# Altium schematic sheet Motortreiber_5,6.SchDoc: SysP18_Team10: Motortreiber 5/6
size A4; CheckedBy: Kyburz Falk; Author: Michael Alig; CompanyName: NTB; Organization: NTB Interstate University of Applied; Address1: Werdenbergstrasse 4; Address3: 9471 Buchs; Address4: Switzerland; Revision: 14.03.2018; SheetNumber: 5; SheetTotal: 5; Organization1: Sciences of Technology Buchs; Size: A4; ShortDescription: Motortreiber Motor 5, Motor6
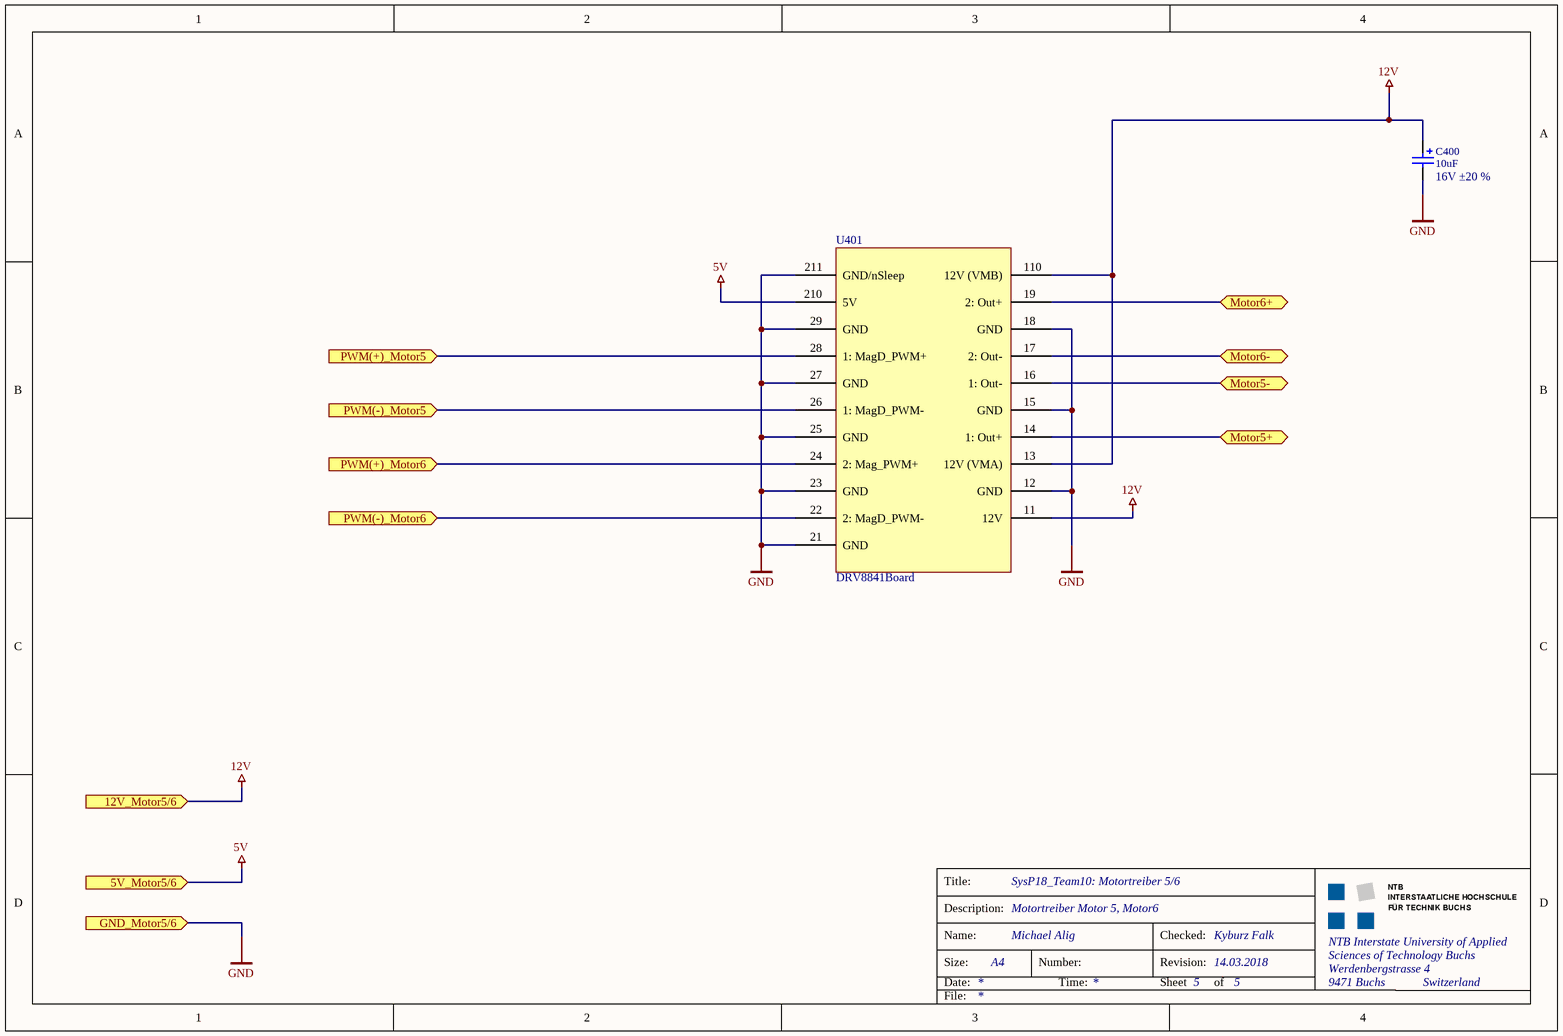
[diagram p0: Motortreiber_5,6.SchDoc]

## Parts
C400  value 10uF  ValueAddon: 16V ±20 %  [CDE_CAP AVE CODE D_H]  (hidden comment: AVE476M16D16T-F)
U401  DRV8841Board  [DRV8841_Board]

## Ports
5V_Motor5/6 (in), 12V_Motor5/6 (in), GND_Motor5/6 (in), Motor5+, Motor5-, Motor6+, Motor6-, PWM(+)_Motor5 (in), PWM(+)_Motor6 (in), PWM(-)_Motor5 (in), PWM(-)_Motor6 (in)

## Nets
5V: U401.210(5V) ; port 5V_Motor5/6
12V: C400.1(Pos) U401.11(12V) U401.13(12V_(VMA)) U401.110(12V_(VMB)) ; port 12V_Motor5/6
GND: C400.2(Neg) U401.12(GND) U401.15(GND) U401.18(GND) U401.21(GND) U401.23(GND) U401.25(GND) U401.27(GND) U401.29(GND) U401.211(GND/nSleep) ; port GND_Motor5/6
Motor5+: U401.14(1:_Out+) ; port Motor5+
Motor5-: U401.16(1:_Out-) ; port Motor5-
Motor6+: U401.19(2:_Out+) ; port Motor6+
Motor6-: U401.17(2:_Out-) ; port Motor6-
PWM(+)_Motor5: U401.28(1:_MagD_PWM+) ; port PWM(+)_Motor5
PWM(+)_Motor6: U401.24(2:_Mag_PWM+) ; port PWM(+)_Motor6
PWM(-)_Motor5: U401.26(1:_MagD_PWM-) ; port PWM(-)_Motor5
PWM(-)_Motor6: U401.22(2:_MagD_PWM-) ; port PWM(-)_Motor6

## Notes on the sheet
- Title:
- Description:
- Size:
- Date:
- Name:
- Number:
- Time:
- Revision:
- Sheet
- Checked:
- of
- File:

## Library data of the parts
C400 = CDE_AVE476M16D16T-F_AVE CODE D: Aluminum Electrolytic Capacitors for Filtering and Bypass, 47uF, 16V; Manufacturer: Cornell Dubilier; #Class: PASSIVE; RefFootprint: CDE_CAP AVE CODE D; #ClassSub: CAPACITOR; Distributor PartNr: 598-AVE476M16D16T-F; Distributor: Mouser; Published: 20121220; Publisher: Stefan Ursella, M.Eng; ComponentLink1Description: Manufacturer Link; ComponentLink2Description: Datasheet; ComponentLink2URL: http://www.cde.com/catalogs/AVE.pdf; ComponentLink3Description: Packaging Specification; Manufacturer PartNr: AVE476M16D16T-F; RefFileFOO: *; RefFileSCH: *; RefSchema: CDE_AVE476M16D16T-F_AVE CODE D
U401 = DRV8841_Board